# EAGLE design controller-board (EAGLE 9.6.2)
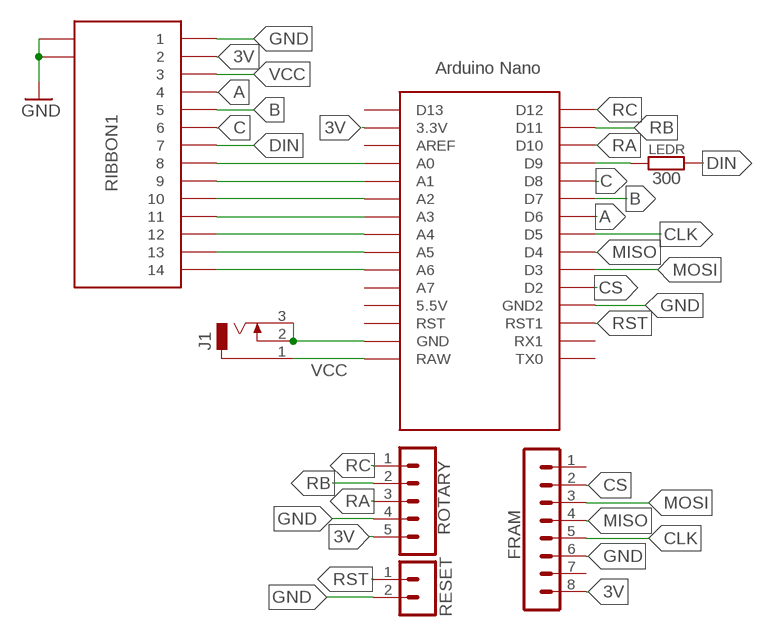
[diagram p0: schematic, sheet 1]

## Parts
FRAM  MB85RS2MTA  MA08-1  [MA08-1]
J1  DCJ0202  [DCJ0202]
LEDR  300  R-EU_0207/10  [0207/10]
RESET  B2B-PH-K  [B2B-PH-K]
RIBBON1  686114148922  [686114148922]
ROTARY  B5B-PH-K  [B5B-PH-K]
U$1  NANO  [NANO]

## Nets
3V: FRAM.8 RIBBON1.2 ROTARY.5 U$1.3.3V
A: RIBBON1.4 U$1.D6
A0: RIBBON1.8 U$1.A0
A1: RIBBON1.9 U$1.A1
A2: RIBBON1.10 U$1.A2
A3: RIBBON1.11 U$1.A3
A5: RIBBON1.13 U$1.A5
B: RIBBON1.5 U$1.D7
C: RIBBON1.6 U$1.D8
CLK: FRAM.5 U$1.D5
CS: FRAM.2 U$1.D2
D9: LEDR.1 U$1.D9
DIN: LEDR.2 RIBBON1.7
GND: FRAM.6 J1.2 J1.3 RESET.2 RIBBON1.1 RIBBON1.MP1 RIBBON1.MP2 ROTARY.4 U$1.GND U$1.GND1(GND2)
MISO: FRAM.4 U$1.D4
MOSI: FRAM.3 U$1.D3
N$1: RIBBON1.12 U$1.A4
N$2: RIBBON1.14 U$1.A6
RA: ROTARY.3 U$1.D10
RB: ROTARY.2 U$1.D11
RC: ROTARY.1 U$1.D12
RST: RESET.1 U$1.RST1
VCC: J1.1 RIBBON1.3 U$1.RAW
Unconnected: FRAM.1 FRAM.7 U$1.5V(5.5V) U$1.A7 U$1.AREF U$1.D13 U$1.ICSP1 U$1.ICSP2 U$1.ICSP3 U$1.ICSP4 U$1.ICSP5 U$1.ICSP6 U$1.RST U$1.RX1 U$1.TX0

## Library data of the parts
FRAM = con-lstb:MA08-1: PIN HEADER; OC_FARNELL: unknown; OC_NEWARK: unknown
J1 = con-jack:DCJ0202: DC POWER JACK Source: DCJ0202.pdf; OC_FARNELL: unknown; OC_NEWARK: unknown
LEDR = rcl:R-EU_: RESISTOR, European symbol; SPICEPREFIX: R
RESET = con-jst-ph:B2B-PH-K: HEADER
RIBBON1 = 686114148922:686114148922: Wurth Elektronik WR-FPC 1mm Pitch 14 Way Horizontal SMT Female FPC Connector, ZIF Bottom Contact Source: Datasheet <https://www.we-online.com/catalog/datasheet/686114148922.pdf>; DESCRIPTION: Wurth Elektronik WR-FPC 1mm Pitch 14 Way Horizontal SMT Female FPC Connector, ZIF Bottom Contact; HEIGHT: 2.3mm; MANUFACTURER_NAME: Wurth Elektronik; MANUFACTURER_PART_NUMBER: 686114148922; MOUSER_PART_NUMBER: 710-686114148922; MOUSER_PRICE-STOCK: https://www.mouser.co.uk/ProductDetail/Wurth-Elektronik/686114148922?qs=a9WhcLg8qCz0mPj5zZqo5g%3D%3D
ROTARY = con-jst-ph:B5B-PH-K: HEADER
U$1 = Arduino-clone:NANO: Arduino Nano

## Board
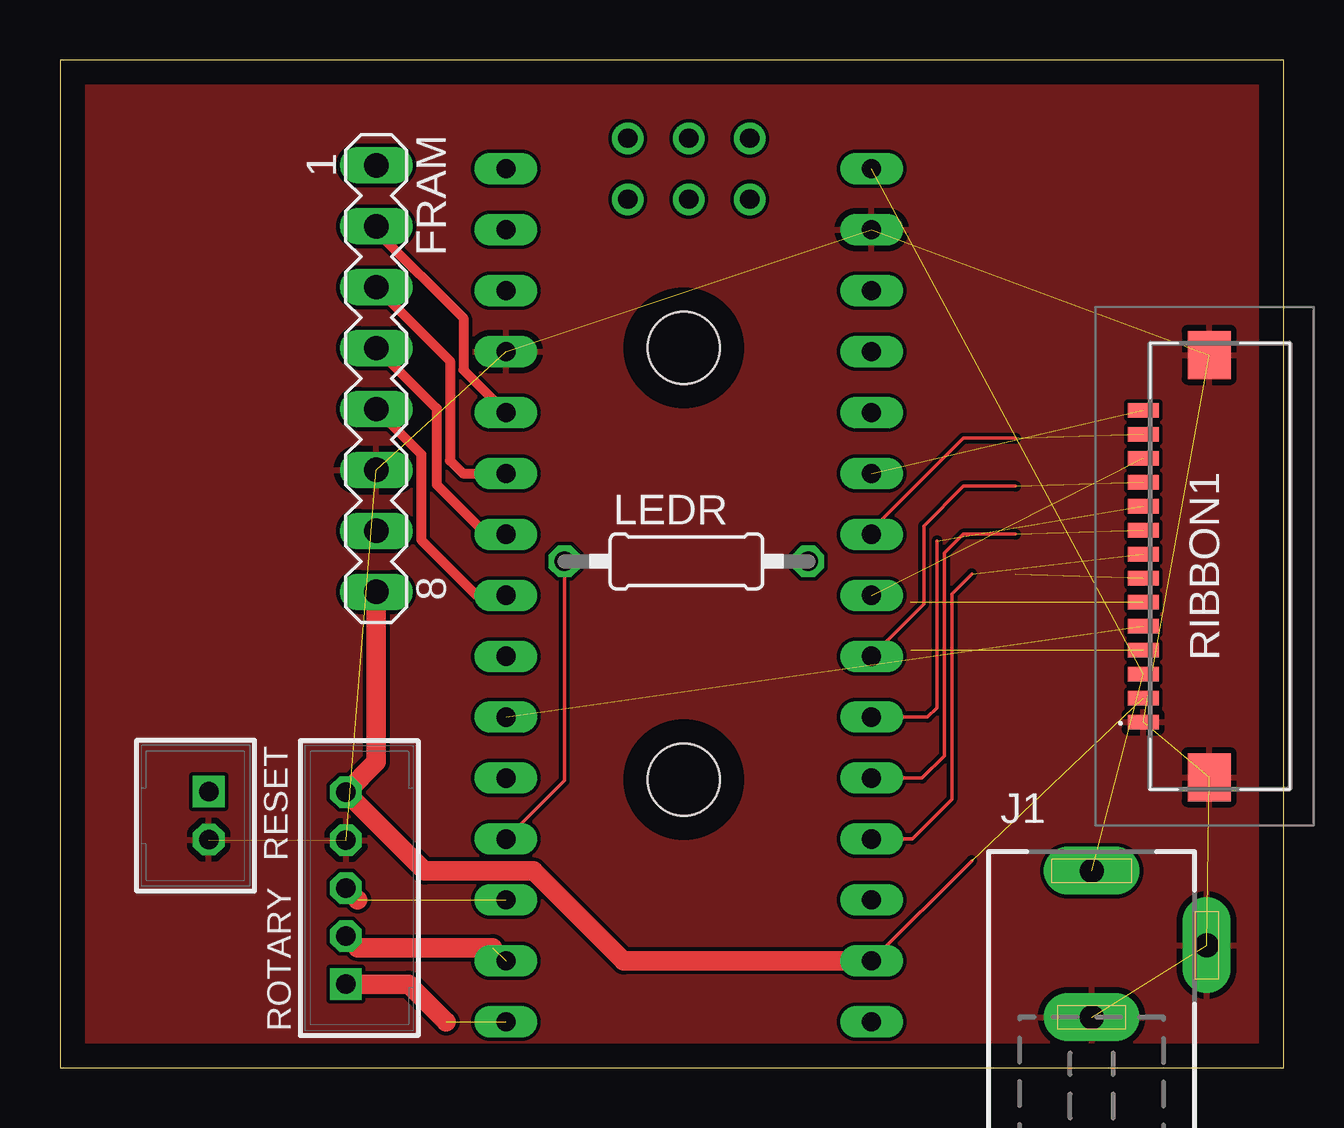
[diagram p1: board, top side]
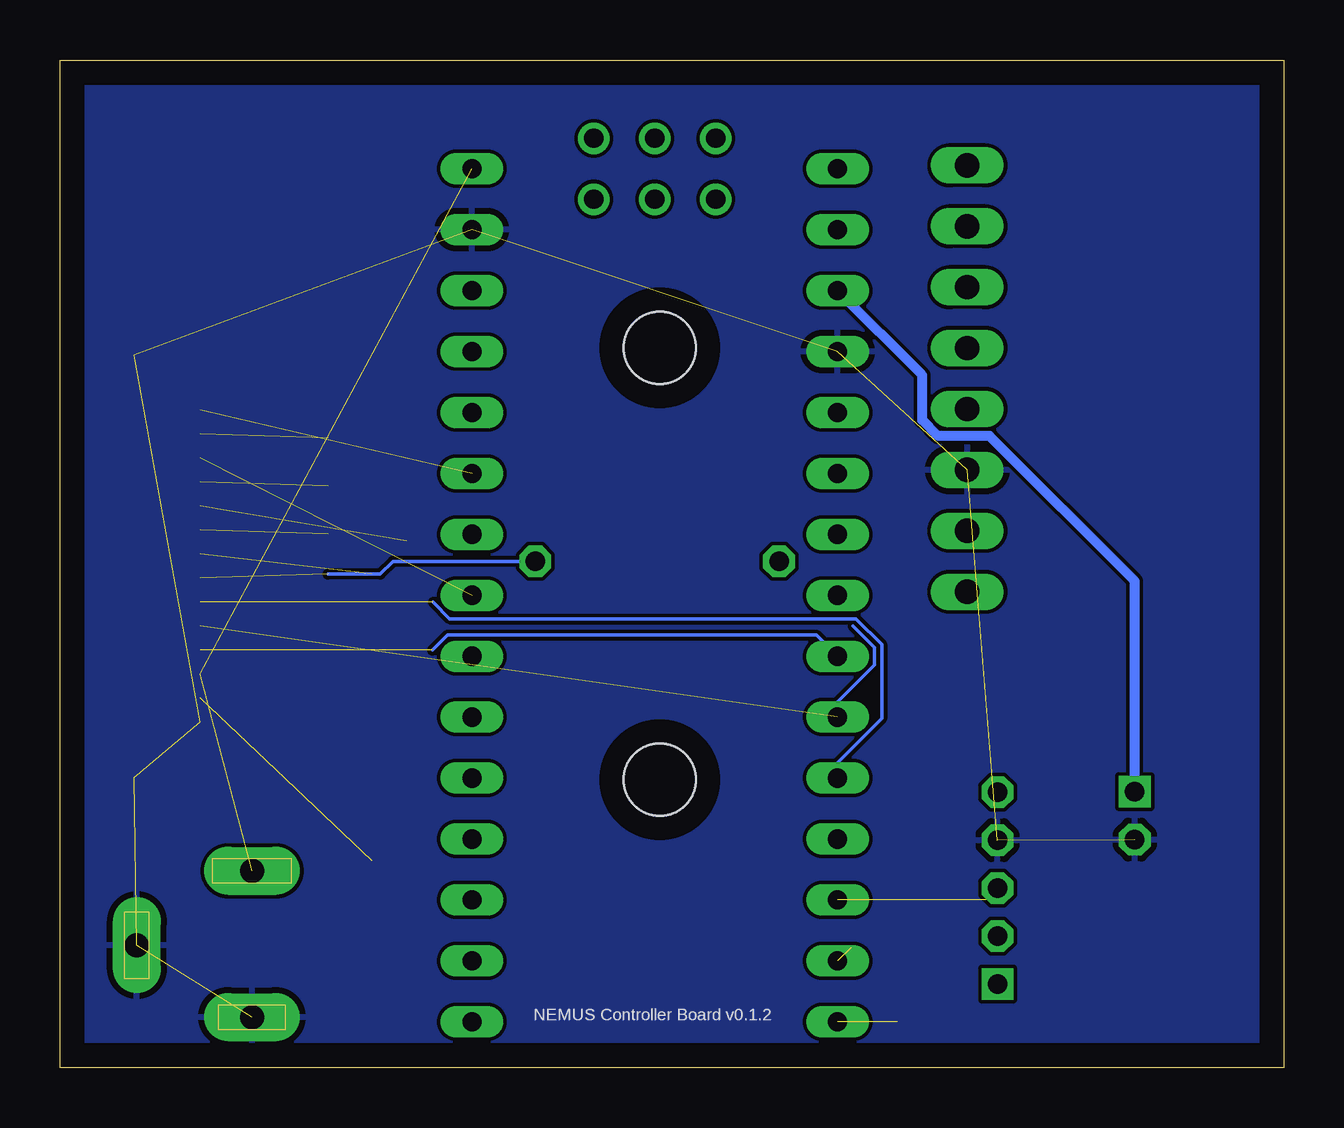
[diagram p2: board, bottom side, seen from below]

Size 51 x 42 mm. Coordinates in mm from the lower left corner, seen from the top.
Outline: 0,0 51,0 51,42 0,42 0,0
Copper layers (1*16): Top 0.035mm / dielectric 1.5mm / Bottom 0.035mm
Design rules "default": minimum track width 6mil, minimum drill 0.35mm, track to track 6mil, track to pad 6mil, pad to pad 6mil, via to via 6mil, smd to smd 6mil, copper to edge 40mil, drill to drill 6mil, minimum pad ring 10mil, minimum via ring 8mil, stop-mask expansion 4mil, vias tented up to drill 0mil, thermal gap 10mil
Holes 3 mm at 26,30 26,12

### Footprints (pad centres in the part's own frame; a part is rotated, then mirrored left to right if it is on the bottom)
MA08-1 = drill 1.016 long: 1 -8.89,0; 2 -6.35,0; 3 -3.81,0; 4 -1.27,0; 5 1.27,0; 6 3.81,0; 7 6.35,0; 8 8.89,0
DCJ0202 = drill 1 pad 2 long: 1 0,3.1; 2 4.8,0; 3 0,-3
0207/10 = drill 0.813 octagon: 1 -5.08,0; 2 5.08,0
B2B-PH-K = drill 0.813 square: 1 -1,0 | drill 0.813 octagon: 2 1,0
686114148922 = smd 0.6 x 1.3: 1 -6.5,3.05; 2 -5.5,3.05; 3 -4.5,3.05; 4 -3.5,3.05; 5 -2.5,3.05; 6 -1.5,3.05; 7 -0.5,3.05; 8 0.5,3.05; 9 1.5,3.05; 10 2.5,3.05; 11 3.5,3.05; 12 4.5,3.05; 13 5.5,3.05; 14 6.5,3.05 | smd 2 x 1.8: MP1 -8.8,0.3; MP2 8.8,0.3
B5B-PH-K = drill 0.813 square: 1 -4,0 | drill 0.813 octagon: 2 -2,0; 3 0,0; 4 2,0; 5 4,0
NANO = drill 0.8 long: 3.3V -10.16,24.13; 5V -10.16,-1.27; A0 -10.16,19.05; A1 -10.16,16.51; A2 -10.16,13.97; A3 -10.16,11.43; A4 -10.16,8.89; A5 -10.16,6.35; A6 -10.16,3.81; A7 -10.16,1.27; AREF -10.16,21.59; D2 5.08,1.27; D3 5.08,3.81; D4 5.08,6.35; D5 5.08,8.89; D6 5.08,11.43; D7 5.08,13.97; D8 5.08,16.51; D9 5.08,19.05; D10 5.08,21.59; D11 5.08,24.13; D12 5.08,26.67; D13 -10.16,26.67; GND -10.16,-6.35; GND1 5.08,-1.27; RAW -10.16,-8.89; RST -10.16,-3.81; RST1 5.08,-3.81; RX1 5.08,-6.35; TX0 5.08,-8.89 | drill 0.8: ICSP1 -5.08,-10.16; ICSP2 -5.08,-7.62; ICSP3 -2.54,-10.16; ICSP4 -2.54,-7.62; ICSP5 0,-10.16; ICSP6 0,-7.62

### Placement (x,y rotation side)
FRAM  13.18,28.72 270 top
J1  43,5.1 0 top
LEDR  26.11,21.1 0 top
RESET  6.2,10.5 270 top
RIBBON1  48.2,20.9 90 top
ROTARY  11.92,7.48 90 top
U$1  23.67,28.57 180 top

### Tracks (layer width: path | path; a pad name or v marks a point on that pad's centre or on a via)
3V  (1 unrouted)
  Top 0.152: 38,8.62 U$1.3.3V
  Top 0.813: U$1.3.3V 23.5,4.45 19.75,8.2 15.2,8.2 ROTARY.5 13.18,12.74 FRAM.8
A  (1 unrouted)
  Bottom 0.152: 35.48,17.4 34.85,18.03 19.47,18.03 U$1.D6
A0  (1 unrouted)
  Top 0.152: 38,20.58 37.17,19.75 37.17,11.17 35.52,9.53 U$1.A0
A1  (1 unrouted)
  Top 0.152: 39.83,22.23 37.66,22.23 36.86,21.44 36.86,13 35.93,12.06 U$1.A1
A2  (1 unrouted)
  Top 0.152: 36.56,21.96 36.56,15 36.16,14.61 U$1.A2
A3  (1 unrouted)
  Top 0.152: 39.83,24.23 37.66,24.23 36,22.58 36,19.32 U$1.A3
A5  (1 unrouted)
  Top 0.152: 39.83,26.23 37.66,26.23 33.83,22.41 U$1.A5
B  (1 unrouted)
  Bottom 0.152: 17.94,18.4 17.05,17.51 17.05,16.78 18.59,15.24 U$1.D7
C  (1 unrouted)
  Bottom 0.152: 35.45,19.4 34.75,18.7 17.82,18.7 16.75,17.64 16.75,14.54 18.59,12.7 U$1.D8
CLK
  Top 0.406: FRAM.5 15.06,25.57 15.06,22 17.38,19.68 U$1.D5
CS
  Top 0.406: U$1.D2 16.82,29.08 16.82,31.23 13.18,34.87 FRAM.2
D9
  Top 0.152: U$1.D9 21.03,11.97 LEDR.1
DIN  (1 unrouted)
  Bottom 0.152: LEDR.2 37.12,21.1 37.66,20.57 39.83,20.57
GND  (9 unrouted)
  pour Top: 0,0 0,42 51,42 51,0
  pour Bottom: 0,0 0,42 51,42 51,0
MISO
  Top 0.406: FRAM.4 15.7,27.47 15.7,24.3 17.77,22.23 U$1.D4
MOSI
  Top 0.406: FRAM.3 16.26,29.45 16.26,25.3 16.79,24.77 U$1.D3
N$1  (1 unrouted)
N$2  (1 unrouted)
RA  (1 unrouted)
  Top 0.813: ROTARY.3 12.41,6.99
RB  (1 unrouted)
  Top 0.813: ROTARY.2 12.4,5 18.03,5
RC  (1 unrouted)
  Top 0.813: ROTARY.1 14.52,3.48 16.09,1.91
RST
  Bottom 0.406: U$1.RST1 15.06,28.86 15.06,26.99 14.4,26.33 12.26,26.33 6.2,20.27 RESET.1
VCC  (2 unrouted)

### Text on the board
bNames: NEMUS Controller Board v0.1.2